# EAGLE design Universal-WIFI (EAGLE 9.7.0)
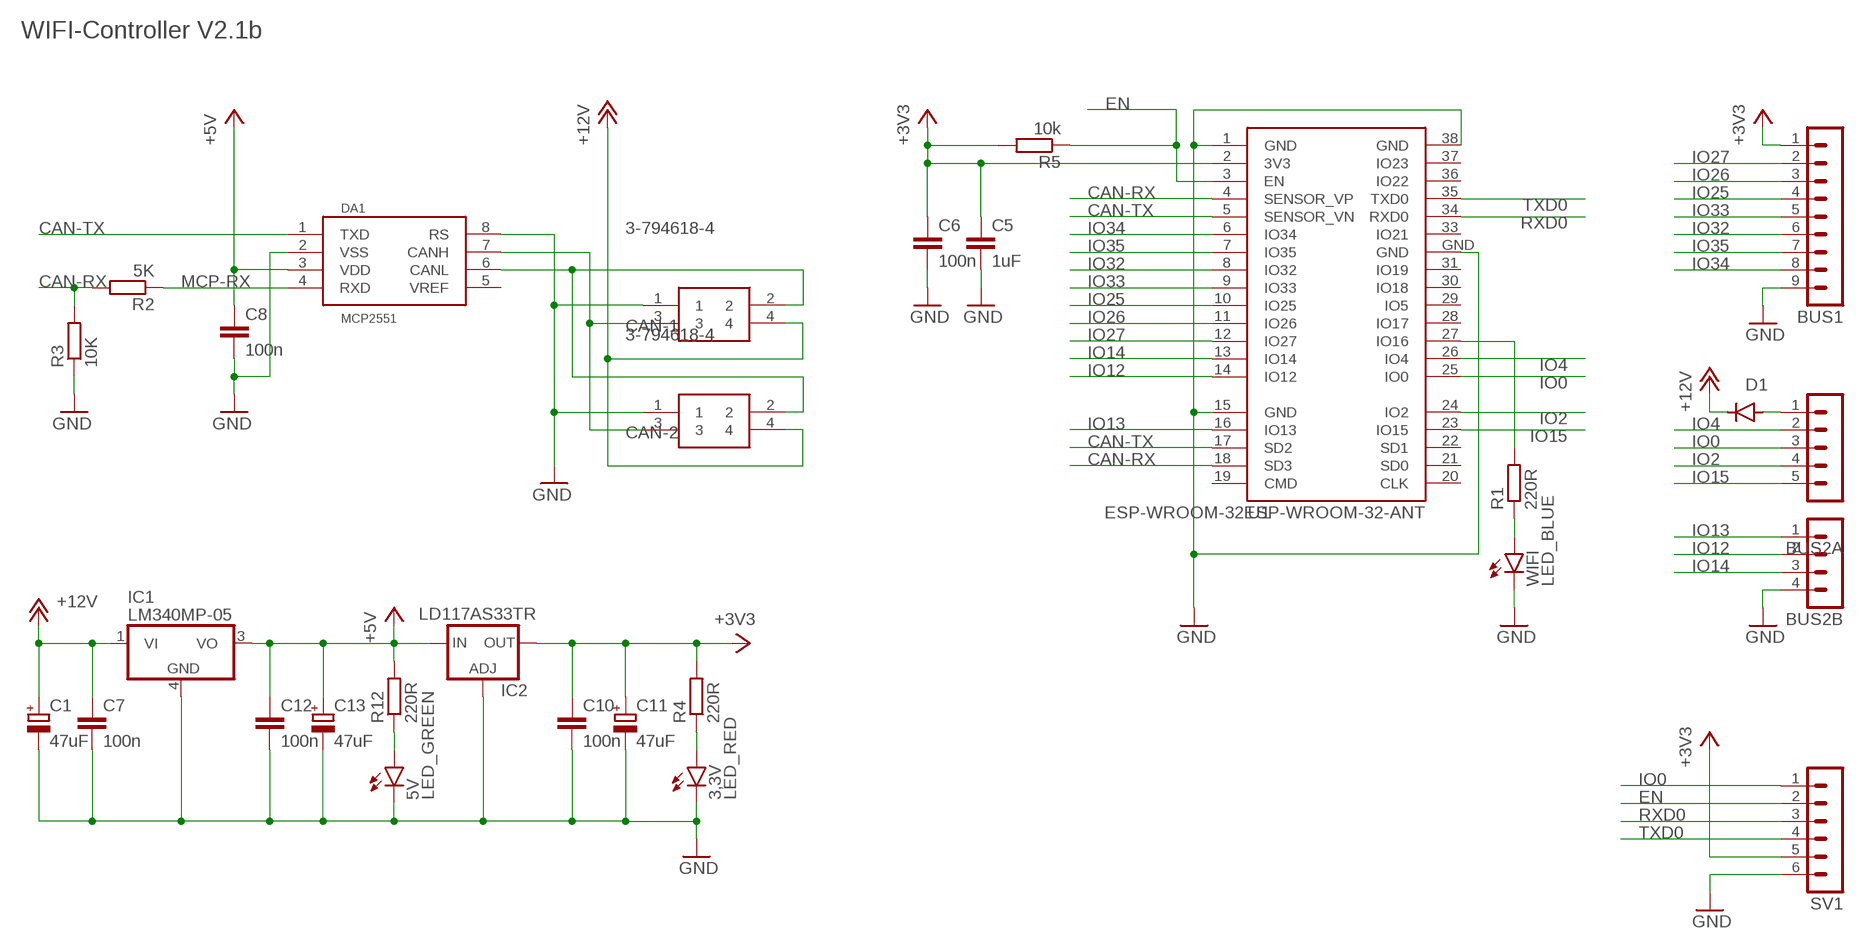
[diagram p0: schematic, sheet 1]

## Parts
3,3V  LED_RED  LED_CHIP_RED-1608  [LEDC1608X39N_R]
5V  LED_GREEN  LED_CHIP_GREEN-1608  [LEDC1608X39N_G]
BUS1  MA09-1  [MA09-1]
BUS2A  MA05-1  [MA05-1]
BUS2B  MA04-1  [MA04-1]
C1  47uF  CPOL-EUB/3528-21R  [B/3528-21R]
C5  1uF  C-EUC0402  [C0402]
C6  100n  C-EUC0402  [C0402]
C7  100n  C-EUC0402  [C0402]
C8  100n  C-EUC0402  [C0402]
C10  100n  C-EUC0402  [C0402]
C11  47uF  CPOL-EUB/3528-21R  [B/3528-21R]
C12  100n  C-EUC0402  [C0402]
C13  47uF  CPOL-EUB/3528-21R  [B/3528-21R]
CAN-1  3-794618-4  [SHDRRA4W102P300_2X2_686X892X73]
CAN-2  3-794618-4  [SHDRRA4W102P300_2X2_686X892X73]
D1  DIODE-DO-214AC  [DO-214AC]
DA1  MCP2551  TJA1050  [SO08]
IC1  LM340MP-05  [SOT223]
IC2  LD117AS33TR  [SOT223]
R1  220R  R-EU_R0805  [R0805]
R2  5K  R-EU_R0805  [R0805]
R3  10K  R-EU_R0805  [R0805]
R4  220R  R-EU_R0805  [R0805]
R5  10k  R-EU_R0805  [R0805]
R12  220R  R-EU_R0805  [R0805]
SV1  MA06-1  [MA06-1]
U1  ESP-WROOM-32ESP-WROOM-32-ANT  [ESP-WROOM-32-ANT]
WIFI  LED_BLUE  LED_CHIP_BLUE-1608  [LEDC1608X39N_B]

## Nets
+3V3: BUS1.1 C5.1 C6.1 C10.1 C11.+ IC2.4(OUT) R4.2 R5.2 SV1.5 U1.2(3V3)
+5V: C8.1 C12.1 C13.+ DA1.3(VDD) IC1.3(VO) IC2.3(IN) R12.2
+12V: C1.+ C7.1 CAN-1.4 CAN-2.4 D1.C IC1.1(VI)
CAN-RX: R2.2 R3.2 U1.4(SENSOR_VP) U1.18(SD3)
CAN-TX: DA1.1(TXD) U1.5(SENSOR_VN) U1.17(SD2)
EN: R5.1 SV1.2 U1.3(EN)
GND: 3,3V.1(C) 5V.1(C) BUS1.9 BUS2B.4 C1.- C5.2 C6.2 C7.2 C8.2 C10.2 C11.- C12.2 C13.- CAN-1.1 CAN-2.1 DA1.2(VSS) DA1.8(RS) IC1.4(GND) IC2.1(ADJ) R3.1 SV1.6 U1.1(GND) U1.15(GND) U1.38(GND) U1.GND WIFI.1(C)
IO0: BUS2A.3 SV1.1 U1.25(IO0)
IO2: BUS2A.4 U1.24(IO2)
IO4: BUS2A.2 U1.26(IO4)
IO12: BUS2B.2 U1.14(IO12)
IO13: BUS2B.1 U1.16(IO13)
IO14: BUS2B.3 U1.13(IO14)
IO15: BUS2A.5 U1.23(IO15)
IO25: BUS1.4 U1.10(IO25)
IO26: BUS1.3 U1.11(IO26)
IO27: BUS1.2 U1.12(IO27)
IO32: BUS1.6 U1.8(IO32)
IO33: BUS1.5 U1.9(IO33)
IO34: BUS1.8 U1.6(IO34)
IO35: BUS1.7 U1.7(IO35)
MCP-RX: DA1.4(RXD) R2.1
N$1: BUS2A.1 D1.A
N$2: R1.2 U1.27(IO16)
N$3: R1.1 WIFI.2(A)
N$6: 3,3V.2(A) R4.1
N$8: CAN-1.3 CAN-2.3 DA1.7(CANH)
N$9: CAN-1.2 CAN-2.2 DA1.6(CANL)
N$13: 5V.2(A) R12.1
RXD0: SV1.3 U1.34(RXD0)
TXD0: SV1.4 U1.35(TXD0)
Unconnected: DA1.5(VREF) U1.19(CMD) U1.20(CLK) U1.21(SD0) U1.22(SD1) U1.28(IO17) U1.29(IO5) U1.30(IO18) U1.31(IO19) U1.33(IO21) U1.36(IO22) U1.37(IO23)

## Notes on the sheet
- WIFI-Controller V2.1b

## Library data of the parts
3,3V = Opto-Electronic:LED_CHIP: LED - Generic; CATEGORY: Opto-Electronic; COLOR: Red; SUB-CATEGORY: LED
5V = Opto-Electronic:LED_CHIP: LED - Generic; CATEGORY: Opto-Electronic; COLOR: Green; SUB-CATEGORY: LED
BUS1 = con-lstb:MA09-1: PIN HEADER; OC_FARNELL: unknown; OC_NEWARK: unknown
BUS2A = con-lstb:MA05-1: PIN HEADER; OC_FARNELL: unknown; OC_NEWARK: unknown
BUS2B = con-lstb:MA04-1: PIN HEADER; OC_FARNELL: unknown; OC_NEWARK: unknown
C1 C11 C13 = rcl:CPOL-EU: POLARIZED CAPACITOR, European symbol; SPICEPREFIX: C
C5-C8 C10 C12 = rcl:C-EU: CAPACITOR, European symbol; SPICEPREFIX: C
CAN-1 CAN-2 = SamacSys_Parts:3-794618-4: 4 way 2 row r/a header Mate-N-Lok Source: Datasheet <https://rs.componentsearchengine.com/Datasheets/2/3-794618-4.pdf>; DESCRIPTION: 4 way 2 row r/a header Mate-N-Lok; HEIGHT: 7.37mm; MANUFACTURER_NAME: TE Connectivity; MANUFACTURER_PART_NUMBER: 3-794618-4
D1 = diode:DIODE-: DIODE
DA1 = TJA1050:TJA1050: High speed CAN transceiver Input levels compatible with 3.3 V and 5 V devices 5V supply
IC1 = linear:LM340?-*: Positive VOLTAGE REGULATOR Source: http://cache.national.com/ds/LM/LM340.pdf
IC2 = v-reg:LD117A?*: Low drop fixed and adjustable positive voltage regulators 1 A Source: http://www.st.com/stonline/products/literature/ds/7194/ld1117axx.pdf
R1-R5 R12 = rcl:R-EU_: RESISTOR, European symbol; SPICEPREFIX: R
SV1 = con-lstb:MA06-1: PIN HEADER; OC_FARNELL: unknown; OC_NEWARK: unknown
U1 = esp32:ESP-WROOM-32: Espressif Systems ESP-WROOM-32
WIFI = Opto-Electronic:LED_CHIP: LED - Generic; CATEGORY: Opto-Electronic; COLOR: Blue; SUB-CATEGORY: LED

## Board
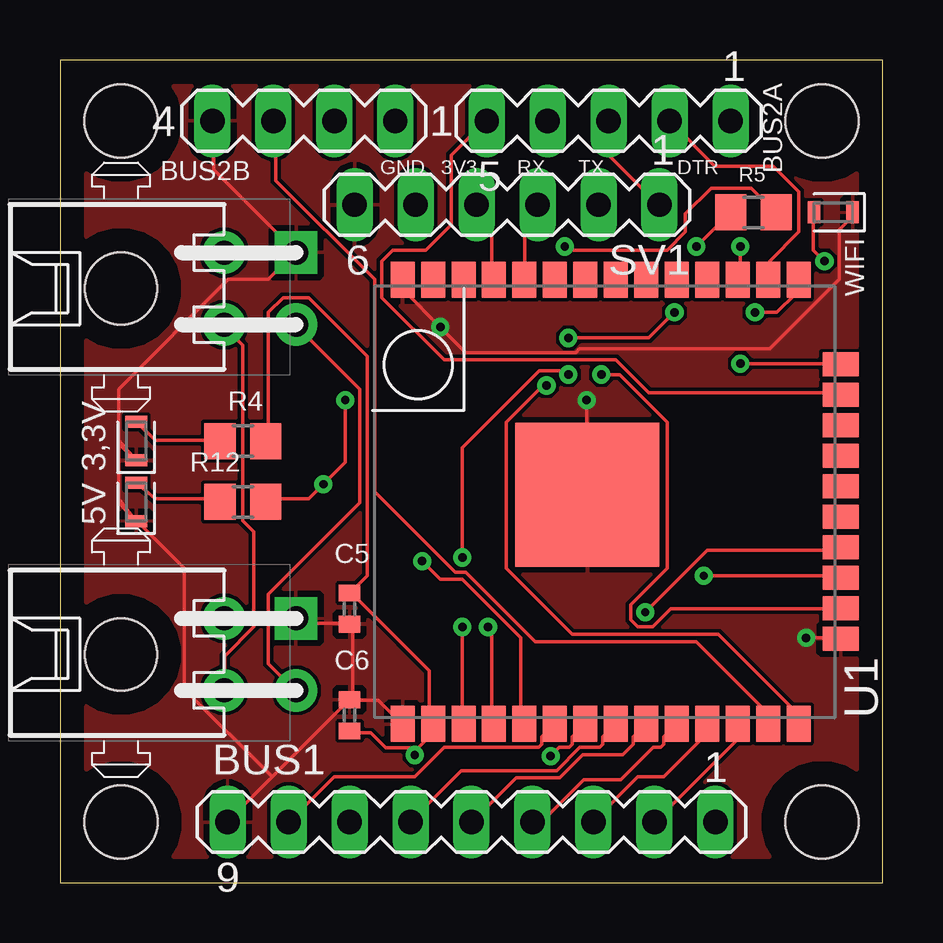
[diagram p1: board, top side]
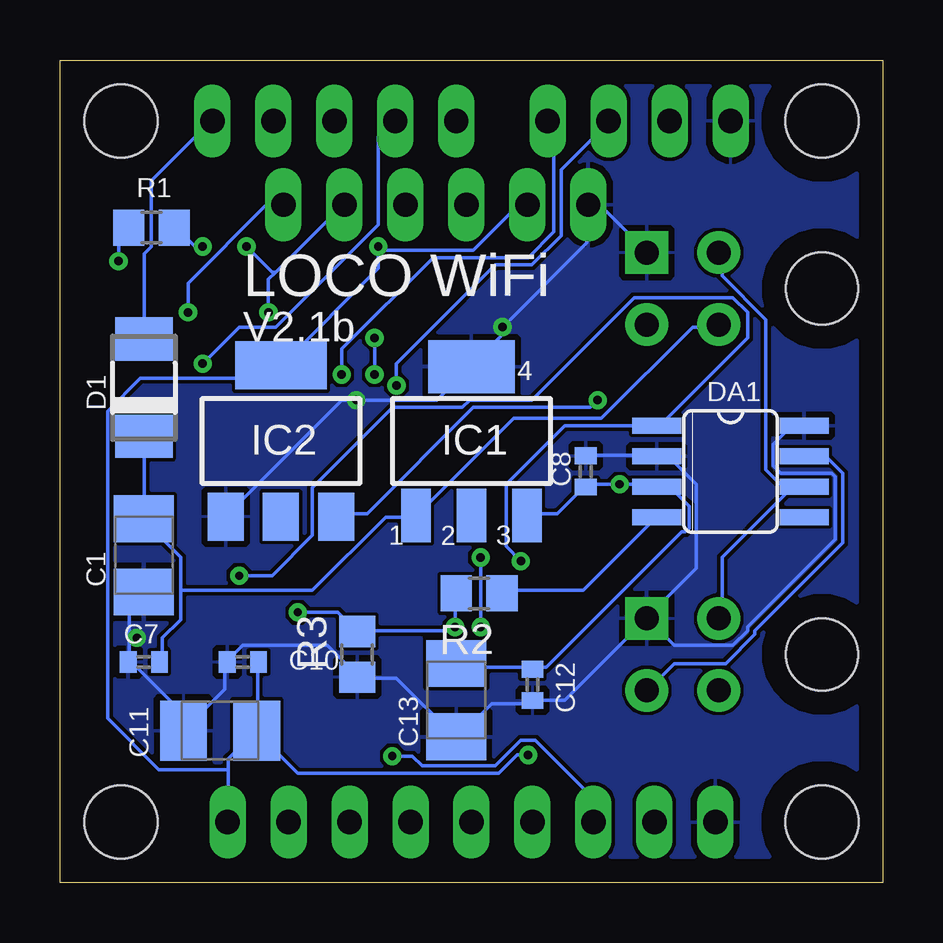
[diagram p2: board, bottom side, seen from below]

Size 34.29 x 34.29 mm. Coordinates in mm from the lower left corner, seen from the top.
Outline: 0,0 34.29,0 34.29,34.29 0,34.29 0,0
Copper layers (1*16): Top / Bottom
Stack-up Default Layer Stack: Top User Defined 0.035mm / Dielectric-1 User Defined 1.5mm / Bottom User Defined 0.035mm
Design rules "default": minimum track width 6mil, minimum drill 0.35mm, track to track 6mil, track to pad 6mil, pad to pad 6mil, via to via 6mil, smd to smd 6mil, copper to edge 40mil, drill to drill 6mil, minimum pad ring 10mil, minimum via ring 8mil, stop-mask expansion 4mil, vias tented up to drill 0mil, thermal gap 10mil
Holes 3.05 mm at 2.54,2.54 31.75,2.54 2.54,31.75 31.75,31.75

### Footprints (pad centres in the part's own frame; a part is rotated, then mirrored left to right if it is on the bottom)
LEDC1608X39N_R = smd 0.512 x 0.912: 1 -0.8,0; 2 0.8,0
LEDC1608X39N_G = smd 0.512 x 0.912: 1 -0.8,0; 2 0.8,0
MA09-1 = drill 1.016 long: 1 -10.16,0; 2 -7.62,0; 3 -5.08,0; 4 -2.54,0; 5 0,0; 6 2.54,0; 7 5.08,0; 8 7.62,0; 9 10.16,0
MA05-1 = drill 1.016 long: 1 -5.08,0; 2 -2.54,0; 3 0,0; 4 2.54,0; 5 5.08,0
MA04-1 = drill 1.016 long: 1 -3.81,0; 2 -1.27,0; 3 1.27,0; 4 3.81,0
B/3528-21R = smd 1.95 x 2.5: + 1.525,0; - -1.525,0
C0402 = smd 0.7 x 0.9: 1 -0.65,0; 2 0.65,0
SHDRRA4W102P300_2X2_686X892X73 = drill 1 pad 1.778 square: 1 1.5,-7.3 | drill 1 pad 1.778: 2 1.5,-4.3; 3 -1.5,-7.3; 4 -1.5,-4.3 | hole 3: 0,0
DO-214AC = smd 1.8 x 2.4: A 2.025,0; C -2.025,0
SO08 = smd 0.66 x 2.032: 1 -1.905,-3.073; 2 -0.635,-3.073; 3 0.635,-3.073; 4 1.905,-3.073; 5 1.905,3.073; 6 0.635,3.073; 7 -0.635,3.073; 8 -1.905,3.073
SOT223 = smd 1.219 x 2.235: 1 -2.311,-3.099; 2 0,-3.099; 3 2.311,-3.099 | smd 3.6 x 2.2: 4 0,3.099
SOT223' = smd 1.5 x 2: 1 -2.3,-3.15; 2 0,-3.15; 3 2.3,-3.15 | smd 3.8 x 2: 4 0,3.15
R0805 = smd 1.3 x 1.5: 1 -0.95,0; 2 0.95,0
MA06-1 = drill 1.016 long: 1 -6.35,0; 2 -3.81,0; 3 -1.27,0; 4 1.27,0; 5 3.81,0; 6 6.35,0
ESP-WROOM-32-ANT = smd 1.5 x 1: 1 -9.25,7; 2 -9.25,5.73; 3 -9.25,4.46; 4 -9.25,3.19; 5 -9.25,1.92; 6 -9.25,0.65; 7 -9.25,-0.62; 8 -9.25,-1.89; 9 -9.25,-3.16; 10 -9.25,-4.43; 11 -9.25,-5.7; 12 -9.25,-6.97; 13 -9.25,-8.24; 14 -9.25,-9.51; 25 9.25,-9.51; 26 9.25,-8.24; 27 9.25,-6.97; 28 9.25,-5.7; 29 9.25,-4.43; 30 9.25,-3.16; 31 9.25,-1.89; 32 9.25,-0.62; 33 9.25,0.65; 34 9.25,1.92; 35 9.25,3.19; 36 9.25,4.46; 37 9.25,5.73; 38 9.25,7 | smd 1 x 1.5: 15 -5.7,-11.25; 16 -4.43,-11.25; 17 -3.16,-11.25; 18 -1.89,-11.25; 19 -0.62,-11.25; 20 0.65,-11.25; 21 1.92,-11.25; 22 3.19,-11.25; 23 4.46,-11.25; 24 5.73,-11.25 | smd 6 x 6: GND 0.3,-0.7
LEDC1608X39N_B = smd 0.512 x 0.912: 1 -0.8,0; 2 0.8,0

### Placement (x,y rotation side)
3,3V  3.17,18.41 90 top
5V  3.17,15.88 90 top
BUS1  17.14,2.54 180 top
BUS2A  22.86,31.75 180 top
BUS2B  10.16,31.75 180 top
C1  30.8,13.65 90 bottom
C5  12.06,11.43 270 top
C6  12.06,6.99 90 top
C7  30.8,9.21 180 bottom
C8  12.38,17.14 90 bottom
C10  26.67,9.21 180 bottom
C11  27.62,6.35 0 bottom
C12  14.61,8.26 270 bottom
C13  17.78,7.62 90 bottom
CAN-1  2.54,9.53 90 top
CAN-2  2.54,24.77 90 top
D1  30.8,20.64 90 bottom
DA1  6.35,17.14 270 bottom
IC1  17.14,18.41 0 bottom
IC2  LD117AS33TR  [SOT223']  25.08,18.41 0 bottom
R1  30.48,27.3 0 bottom
R2  16.83,12.06 180 bottom
R3  21.91,9.53 90 bottom
R4  7.62,18.41 0 top
R5  28.89,27.94 0 top
R12  7.62,15.88 0 top
SV1  18.63,28.26 180 top
U1  21.27,15.88 90 top
WIFI  32.22,27.94 180 top

### Tracks (layer width: path | path; a pad name or v marks a point on that pad's centre or on a via)
+3V3  (via drill 0.35)
  Top 0.152: 14.78,5.64 14.94,5.64 15.39,6.1 15.39,6.55 U1.2 15.39,6.71 15.39,8.84 12.19,12.04 C5.1 12.19,12.19 12.8,12.8 12.8,21.95 10.36,24.38 9.3,24.38 8.69,23.77 8.69,18.44 R4.2 | 14.78,5.64 13.56,5.64 12.95,6.25 12.19,6.25 C6.1 | v21.03,26.52 21.18,26.36 25.3,26.36 26.06,27.13 26.06,27.89 27.13,28.96 28.8,28.96 29.72,28.04 R5.2 | v14.78,5.33 14.78,5.64
  Bottom 0.152: C10.1 26.06,9.14 26.06,6.4 C11.+ | 27.28,4.72 27.28,5.18 26.21,6.25 C11.+ | 27.28,4.72 27.28,2.59 BUS1.1 | 21.03,26.36 21.03,25.6 24.99,21.64 IC2.4 25.15,21.49 25.6,21.03 30.94,21.03 32.31,19.66 32.31,6.86 30.18,4.72 27.28,4.72 | 21.03,26.36 17.07,26.36 15.24,28.19 14.94,28.19 SV1.5 | 21.03,26.36 v21.03,26.52 | v14.78,5.33 15.24,5.33 16,4.57 24.38,4.57 26.06,6.25 C11.+
+5V  (via drill 0.35)
  Top 0.152: R12.2 8.69,16 10.36,16 v10.97,16.61 11.89,17.53 v11.89,20.12
  Bottom 0.152: C13.+ 17.68,9.14 17.53,8.99 14.63,8.99 C12.1 14.48,8.99 14.02,8.99 8.38,14.63 8.23,14.63 8.08,14.78 8.08,15.7 8.84,16.46 9.3,16.46 DA1.3 9.45,16.61 v10.97,16.61 12.34,16.61 C8.1 12.5,16.46 13.56,15.39 14.78,15.39 IC1.3 | v11.89,20.12 12.19,19.81 17.07,19.81 21.49,15.39 22.71,15.39 IC2.3
+12V
  Top 0.152: CAN-1.4 6.86,8.08 6.86,9.45 8.08,10.67 8.08,14.63 7.62,15.09 7.62,22.4 6.86,23.16 CAN-2.4
  Bottom 0.152: 29.26,12.19 29.26,13.56 30.79,15.09 C1.+ 30.79,15.24 30.79,18.59 D1.C | 29.26,12.19 29.26,10.97 30.02,10.21 30.02,9.3 C7.1 | 29.26,12.19 23.77,12.19 20.73,15.24 19.51,15.24 IC1.1 19.36,15.39 15.39,19.36 11.73,19.36 7.92,23.16 6.86,23.16 CAN-2.4
CAN-RX  (via drill 0.35)
  Top 0.152: v17.83,10.67 17.98,10.52 17.98,6.71 U1.4 | v24.38,11.28 26.98,13.87 32.46,13.87 U1.18
  Bottom 0.152: R2.2 17.83,12.04 v17.83,10.67 17.98,10.52 21.79,10.52 R3.2 21.95,10.52 22.71,11.28 v24.38,11.28
CAN-TX  (via drill 0.35)
  Top 0.152: v15.09,13.41 15.85,12.65 16.76,12.65 19.2,10.21 19.2,6.71 U1.5 | v26.82,12.8 32.46,12.8 U1.17
  Bottom 0.152: v15.09,13.41 15.7,14.02 15.7,16.61 13.26,19.05 DA1.1 9.3,19.05 5.64,22.71 5.64,23.77 6.25,24.38 10.36,24.38 14.63,20.12 17.22,20.12 17.53,19.81 20.42,19.81 23.77,16.46 23.77,14.48 25.45,12.8 v26.82,12.8
EN  (via drill 0.35)
  Top 0.152: v16.76,10.67 16.76,6.71 U1.3 | v16.76,13.56 16.76,18.14 19.96,21.34 21.03,21.34 v21.18,21.18 | v21.18,22.71 24.54,22.71 v25.6,23.77 | v26.52,26.52 27.89,27.89 R5.1
  Bottom 0.152: v16.76,13.56 v16.76,10.67 | v21.18,22.71 v21.18,21.18 | v25.6,23.77 25.6,25.15 25.3,25.45 | 25.3,25.45 22.55,28.19 SV1.2 | v26.52,26.52 25.45,25.45 25.3,25.45
GND  (via drill 0.35)
  Top 0.152: v31.09,10.21 32.46,10.21 U1.15 | C6.2 12.19,7.62 13.26,7.62 14.17,6.71 U1.1 | CAN-1.1 9.91,10.97 10.06,10.82 12.04,10.82 C5.2 12.19,10.67 12.19,7.77 C6.2 | 8.84,4.42 12.04,7.62 C6.2 | 8.84,4.42 7.01,2.59 BUS1.9 | BUS2B.4 6.4,31.7 6.4,29.72 9.75,26.36 CAN-2.1 9.75,26.21 8.69,25.15 7.01,25.15 2.44,20.57 2.44,18.44 3,3V.1 2.44,18.29 2.44,16 5V.1 2.44,15.85 5.18,13.11 5.18,8.08 8.84,4.42 | U1.38 14.33,24.99 14.33,24.69 v15.85,23.16 16.92,22.1 21.49,22.1 21.64,22.25 29.57,22.25 32.46,25.15 32.46,27.22 33.02,27.77 WIFI.1 | v21.95,20.12 21.95,16.31 U1.GND
  Bottom 0.152: 28.8,6.71 29.11,6.4 C11.- 28.8,6.71 | 28.8,6.71 27.43,8.08 27.43,9.14 C10.2 27.28,9.3 26.67,9.91 23.16,9.91 21.95,8.69 R3.1 21.79,8.53 20.27,8.53 17.83,6.1 C13.- 17.68,6.1 16.31,7.47 14.63,7.47 C12.2 14.48,7.62 13.26,7.62 9.91,10.97 CAN-1.1 | 31.39,10.21 31.39,11.58 30.94,12.04 C1.- | 31.39,10.21 31.39,9.3 | 31.39,10.21 v31.09,10.21 | 31.39,9.3 28.8,6.71 | 31.39,9.3 C7.2 | C8.2 12.34,17.83 9.45,17.83 DA1.2 9.3,17.68 8.84,17.68 7.77,16.61 7.77,13.11 9.75,11.12 CAN-1.1 | DA1.8 3.81,19.05 4.57,18.29 4.57,17.37 4.27,17.07 2.13,17.07 1.98,16.92 1.98,14.33 5.64,10.67 5.64,10.52 6.25,9.91 8.69,9.91 9.75,10.97 CAN-1.1 | CAN-2.1 9.91,26.36 11.73,28.19 12.19,28.19 SV1.6 12.34,28.19 12.34,26.67 v15.85,23.16 15.85,22.86 17.07,21.64 IC1.4 17.22,21.49 18.59,20.12 v21.95,20.12 22.55,20.12 27.28,15.39 IC2.1
  pour Top: 0,34.29 34.29,34.29 34.29,0 0,0
  pour Bottom: 0,34.29 34.29,34.29 34.29,0 0,0
IO0  (via drill 0.35)
  Top 0.152: v28.96,23.77 29.87,23.77 30.63,24.54 30.63,24.99 U1.25 | BUS2A.3 22.86,30.33 24.84,28.35 SV1.1
  Bottom 0.152: v28.96,23.77 28.96,24.99 25.76,28.19 24.99,28.19 SV1.1
IO2  (via drill 0.35)
  Top 0.152: v28.35,21.64 32.46,21.64 U1.24
  Bottom 0.152: v28.35,21.64 26.82,23.16 25.3,23.16 21.03,27.43 21.03,31.09 20.42,31.7 BUS2A.4
IO4
  Top 0.152: BUS2A.2 27.28,29.87 29.72,29.87 30.79,28.8 30.79,27.13 29.57,25.91 29.57,25.15 U1.26
IO12  (via drill 0.35)
  Top 0.152: v20.27,20.73 20.12,20.73 18.59,19.2 18.59,13.11 21.34,10.36 27.43,10.36 30.63,7.16 30.63,6.71 U1.14
  Bottom 0.152: v20.27,20.73 20.27,21.64 16.15,25.76 14.63,25.76 13.41,26.98 13.41,29.72 11.43,31.7 BUS2B.2
IO13  (via drill 0.35)
  Top 0.152: v22.55,21.18 23.32,21.18 25.3,19.2 25.3,13.11 23.77,11.58 23.77,10.97 24.08,10.67 24.69,10.67 25.45,11.43 32.46,11.43 U1.16
  Bottom 0.152: v22.55,21.18 22.55,22.25 18.75,26.06 14.78,26.06 13.72,27.13 13.72,31.55 13.87,31.7 BUS2B.1
IO14
  Top 0.152: U1.13 29.41,6.71 29.41,7.16 26.52,10.06 19.81,10.06 16.92,12.95 16.46,12.95 13.11,16.31 13.11,25.15 8.99,29.26 8.99,31.7 BUS2B.3
IO15
  Top 0.152: U1.23 32.46,20.42 24.54,20.42 23.16,21.79 16,21.79 13.41,24.38 13.41,25.91 13.87,26.36 15.24,26.36 16.31,27.43 16.31,30.33 17.68,31.7 BUS2A.5
IO25
  Top 0.152: U1.10 25.16,6.08 25.16,5.78 25.03,5.65 24.72,5.65 23.37,4.29 21.82,4.29 20.06,2.54 BUS1.4
IO26
  Top 0.152: U1.11 26.82,6.55 26.82,6.1 25.15,4.42 24.08,4.42 22.25,2.59 BUS1.3
IO27
  Top 0.152: U1.12 28.19,6.55 28.19,5.94 24.84,2.59 BUS1.2
IO32
  Top 0.152: BUS1.6 14.63,2.59 16.72,4.68 20.7,4.68 21.66,5.65 22.49,5.65 22.62,5.78 22.62,6.08 U1.8
IO33
  Top 0.152: BUS1.5 17.22,2.59 19,4.37 20.82,4.37 21.79,5.34 23.45,5.34 23.89,5.78 23.89,6.08 U1.9
IO34
  Top 0.152: BUS1.8 9.6,2.59 11.43,4.42 14.78,4.42 16.01,5.65 19.95,5.65 20.08,5.78 20.08,6.08 U1.6
IO35  (via drill 0.35)
  Top 0.152: U1.7 21.35,6.08 21.35,5.78 21.22,5.65 20.8,5.65 v20.45,5.29
  Bottom 0.152: BUS1.7 12.19,2.59 12.19,3.66 14.48,5.94 15.09,5.94 16.15,4.88 19.2,4.88 19.61,5.29 v20.45,5.29
MCP-RX
  Bottom 0.152: R2.1 15.85,12.19 12.5,12.19 9.45,15.24 DA1.4
N$1
  Bottom 0.152: D1.A 30.79,22.71 30.79,26.21 30.48,26.52 30.48,29.26 28.04,31.7 BUS2A.1
N$2  (via drill 0.35)
  Top 0.152: v28.35,26.52 28.35,25.15 U1.27
  Bottom 0.152: v28.35,26.52 28.65,26.52 29.41,27.28 R1.2
N$3  (via drill 0.35)
  Top 0.152: v31.85,25.91 31.39,26.36 31.39,27.74 31.42,27.76 WIFI.2
  Bottom 0.152: v31.85,25.91 31.85,26.98 31.55,27.28 R1.1
N$6
  Top 0.152: 3,3V.2 3.96,18.44 6.55,18.44 R4.1
N$8
  Top 0.152: CAN-2.3 9.91,23.16 12.5,20.57 12.5,15.85 8.69,12.04 8.69,9.14 9.75,8.08 CAN-1.3
  Bottom 0.152: DA1.7 3.2,17.68 2.29,17.68 1.68,17.07 1.68,14.17 5.33,10.52 5.33,10.36 6.55,9.14 8.69,9.14 9.75,8.08 CAN-1.3
N$9
  Bottom 0.152: 3.96,16.31 6.71,13.56 6.71,11.12 CAN-1.2 | 3.96,16.31 3.81,16.46 3.35,16.46 DA1.6 3.96,16.31 | 3.96,16.31 4.88,17.22 4.88,23.47 6.71,25.3 6.71,26.21 CAN-2.2
N$13
  Top 0.152: 5V.2 3.96,16 6.55,16 R12.1
RXD0
  Top 0.152: U1.34 19.36,25.15 19.36,27.74 19.81,28.19 SV1.3
TXD0
  Top 0.152: U1.35 17.98,25.15 17.98,27.58 17.37,28.19 SV1.4

### Text on the board
tNames: GND | 3V3 | RX | TX | DTR
bNames: LOCO WiFi | V2.1b